# Altium schematic sheet [01] SYSTEM_POWER.SchDoc (part 3 of 3)
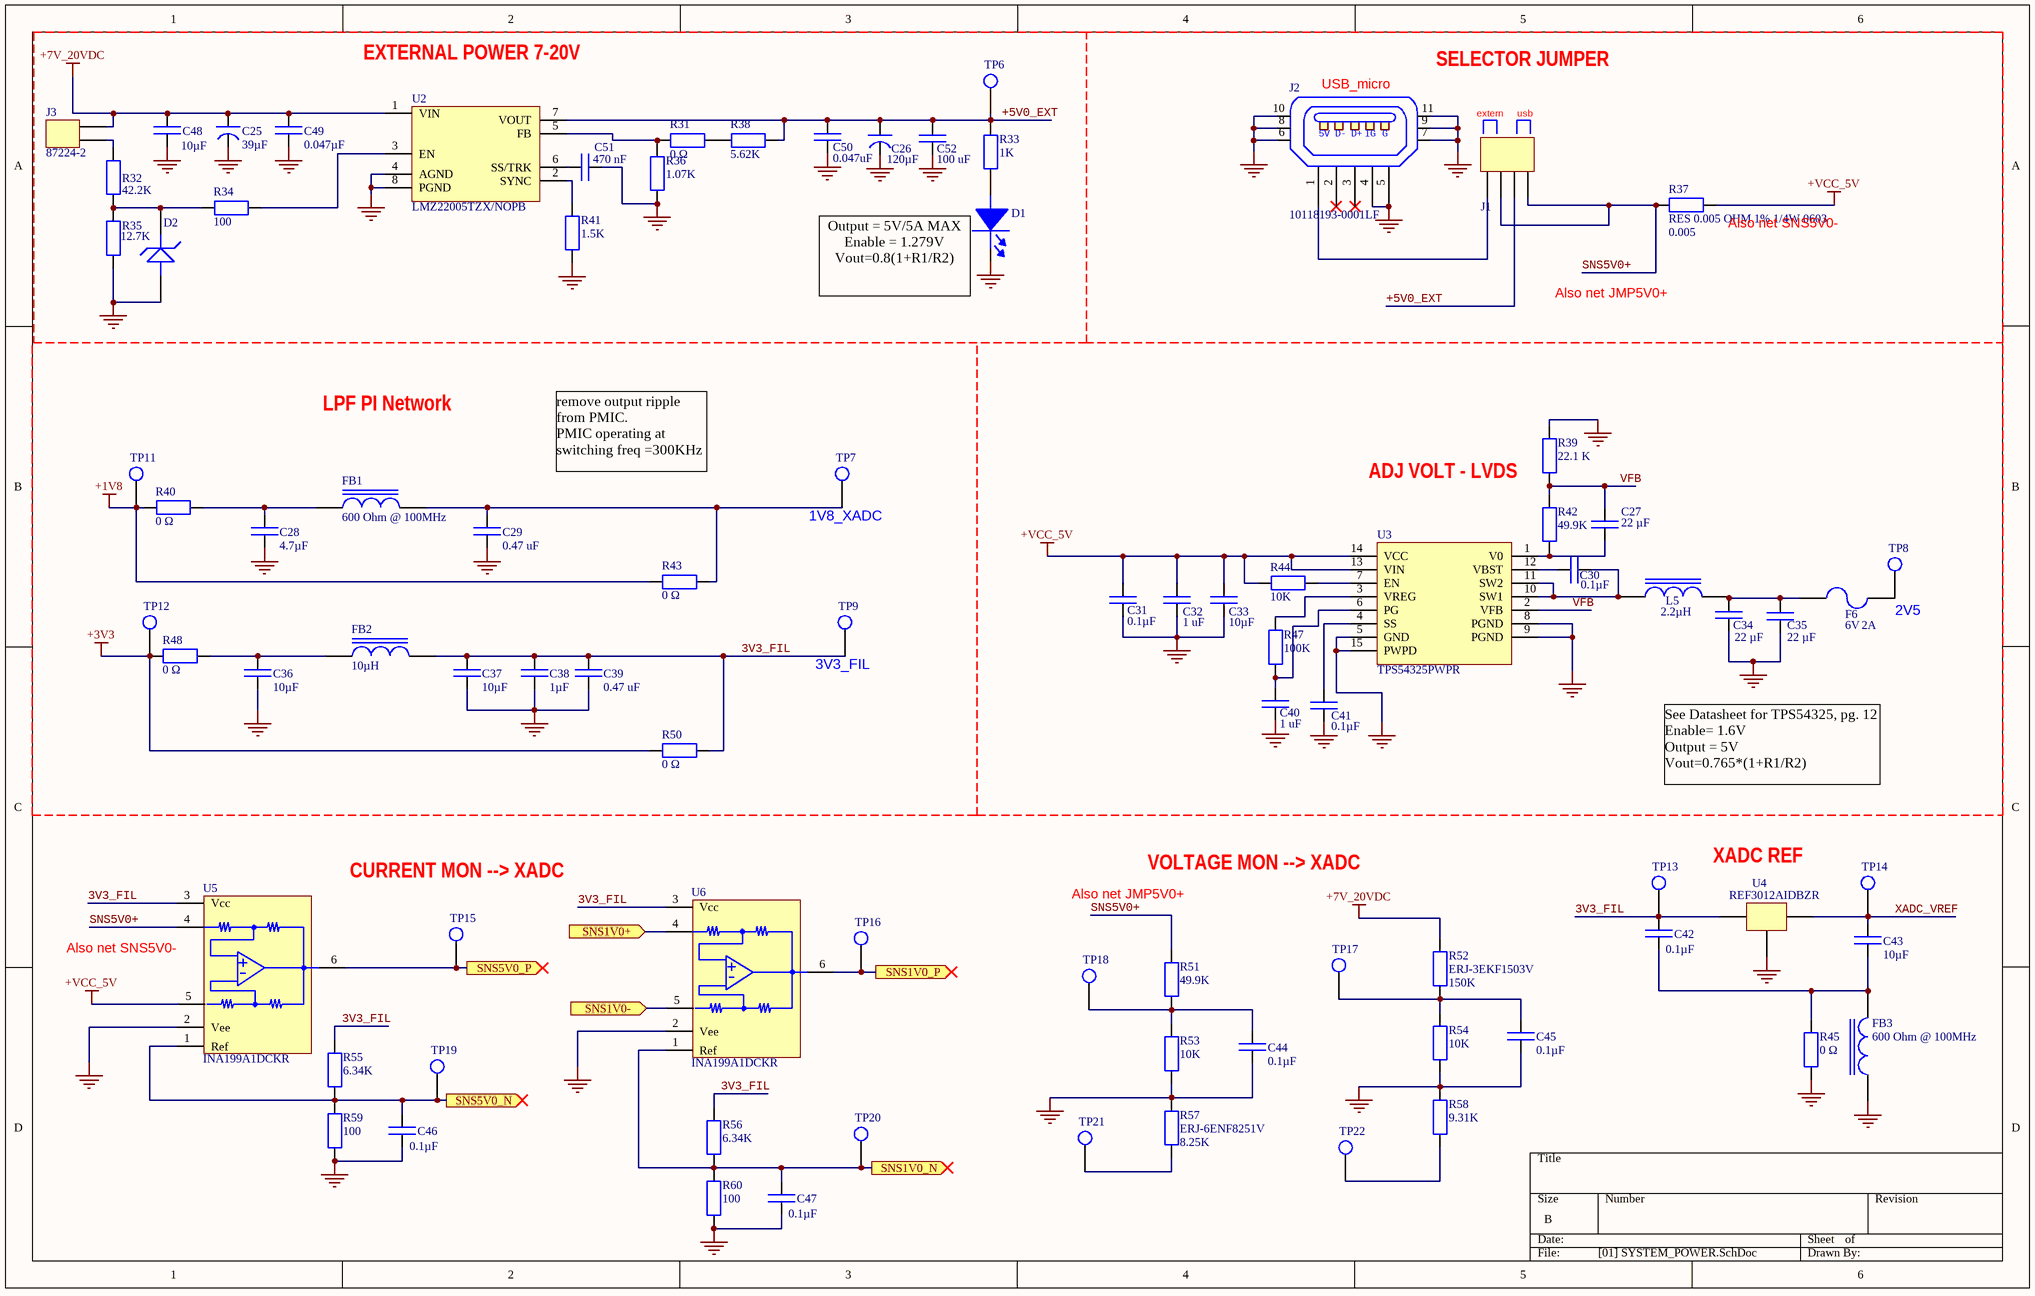
[diagram p2: [01] SYSTEM_POWER.SchDoc]

## Library data of the parts (continued)
R35 = ERJ-3EKF1272V: RES SMD 12.7K OHM 1% 1/10W 0603; Manufacturer: Panasonic; Rated Power: 0.1 W; Temp Coefficient: ±100 ppm/°C; Supplier 1: Digi-Key; Manufacturer Part Number: ERJ-3EKF1272V; Stock 1: 278983; Pricing 1: 1=0.1, 10=0.032, 100=0.013, 1000=0.0058, 2500=0.0051 (USD); Size Code: 0603; Tolerance (%): ±1 %; ComponentLink1URL: http://www.farnell.com/datasheets/1678782.pdf?src-supplier=Element14; ComponentLink1Description: http://www.farnell.com/datasheets/1678782.pdf?src-supplier=Element14; ComponentLink2URL: http://www.farnell.com/datasheets/426256.pdf?src-supplier=Element14; ComponentLink2Description: http://www.farnell.com/datasheets/426256.pdf?src-supplier=Element14; ComponentLink3URL: http://www.alliedelec.com/m/d/623f45ff1957d936ff56d46fd1c28cac.pdf?src-supplier=Allied+Electronics; ComponentLink3Description: http://www.alliedelec.com/m/d/623f45ff1957d936ff56d46fd1c28cac.pdf?src-supplier=Allied+Electronics; ComponentLink4URL: http://industrial.panasonic.com/www-data/pdf/AOA0000/AOA0000CE2.pdf?src-supplier=Avnet; ComponentLink4Description: http://industrial.panasonic.com/www-data/pdf/AOA0000/AOA0000CE2.pdf?src-supplier=Avnet; Supplier Part Number 1: P12.7KHCT-ND
R36 = ERJ-6ENF1071V: RES SMD 1.07K OHM 1% 1/8W 0805; Manufacturer: Panasonic; EDA / CAD Models: Download from Accelerated Designs; Power (Watts): 0.125W, 1/8W; Temperature Coefficient: ±100ppm/°C; Online Catalog: ERJ Series; Kits: RSM3CA-ND  - RES KIT 1K-9.76K 1/8W 4800PCS RSM3C-ND  - RES KIT 1K-9.76K 1/8W 19200PCS; Other Names: ERJ-6ENF1071 ERJ6ENF1071 P1.07KCBK P1.07KCCT; Supplier 1: Digi-Key; Manufacturer Part Number: ERJ-6ENF1071V; Stock 1: 40812; Pricing 1: 1=0.1, 10=0.072, 100=0.0275, 1000=0.0121, 2500=0.0105 (USD); Standard Package: 1; Category: Resistors; Family: Chip Resistor - Surface Mount; Series: ERJ; Packaging: Cut Tape (CT); Tolerance: ±1%; Composition: Thick Film; Features: Automotive AEC-Q200; Operating Temperature: -55°C ~ 155°C; Package / Case: 0805 (2012 Metric); Supplier Device Package: 0805; Size / Dimension: 0.079" L x 0.049" W (2.00mm x 1.25mm); Height: 0.028" (0.70mm); Number of Terminations: 2; ComponentLink1URL: http://industrial.panasonic.com/www-data/pdf/AOA0000/AOA0000CE2.pdf?src-supplier=Avnet; ComponentLink1Description: http://industrial.panasonic.com/www-data/pdf/AOA0000/AOA0000CE2.pdf?src-supplier=Avnet; ComponentLink2URL: http://www.mouser.com/ds/2/315/AOA0000C283-1093288.pdf?src-supplier=Mouser; ComponentLink2Description: http://www.mouser.com/ds/2/315/AOA0000C283-1093288.pdf?src-supplier=Mouser; Supplier Part Number 1: P1.07KCCT-ND
R37 = ERJ-3LWFR005V: Manufacturer: Panasonic; Power (Watts): 0.25W, 1/4W; Temperature Coefficient: 0/ +700ppm/°C; Supplier 1: Digi-Key; Manufacturer Part Number: ERJ-3LWFR005V; Stock 1: 76322; Pricing 1: 1=0.51, 10=0.39, 25=0.2964, 50=0.2202, 100=0.1638, 250=0.1384, 500=0.1186, 1000=0.0904 (USD); Category: Resistors; Family: Chip Resistor - Surface Mount; Series: ERJ; Packaging: Tape & Reel (TR); Tolerance: ±1%; Composition: Thick Film; Features: Automotive AEC-Q200, Current Sense; Operating Temperature: -55°C ~ 125°C; Package / Case: 0603 (1608 Metric); Supplier Device Package: 0603; Size / Dimension: 0.063" L x 0.031" W (1.60mm x 0.80mm); Height: 0.026" (0.65mm); Number of Terminations: 2; ComponentLink1URL: http://www.mouser.com/ds/2/315/AOA0000C295-1109214.pdf?src-supplier=Mouser; ComponentLink1Description: http://www.mouser.com/ds/2/315/AOA0000C295-1109214.pdf?src-supplier=Mouser; ComponentLink2URL: https://industrial.panasonic.com/cdbs/www-data/pdf/RDN0000/AOA0000C313.pdf?src-supplier=Digi-Key; ComponentLink2Description: https://industrial.panasonic.com/cdbs/www-data/pdf/RDN0000/AOA0000C313.pdf?src-supplier=Digi-Key; ComponentLink3URL: http://www.farnell.com/datasheets/2631545.pdf?src-supplier=Farnell; ComponentLink3Description: http://www.farnell.com/datasheets/2631545.pdf?src-supplier=Farnell; ComponentLink4URL: http://www.farnell.com/datasheets/2631545.pdf?src-supplier=Newark; ComponentLink4Description: http://www.farnell.com/datasheets/2631545.pdf?src-supplier=Newark; Supplier Part Number 1: P19182CT-ND
R38 = ERJ-6ENF5621V: RES SMD 5.62K OHM 1% 1/8W 0805; Manufacturer: Panasonic; Resistor Element Type: Thick Film; Product Range: PANASONIC - ERJ Series; Power Rating: 125mW; Resistor Case Style: 0805 [2012 Metric]; Temperature Coefficient: ± 100ppm/°C; Voltage Rating: 150V; SVHC: Diboron trioxide (19-Dec-2012); SVHC (Secondary): Lead monoxide (lead oxide) (19-Dec-2012); Supplier 1: Digi-Key; Manufacturer Part Number: ERJ-6ENF5621V; Stock 1: 24844; Pricing 1: 1=0.1, 10=0.072, 100=0.0275, 1000=0.0121, 2500=0.0105 (USD); Resistance Tolerance: ± 1%; Resistor Element Material: Thick Film; Packaging: Cut Tape; MSL: (Not Applicable); Resistor Mounting: SMD; ComponentLink1URL: http://industrial.panasonic.com/www-data/pdf/AOA0000/AOA0000CE2.pdf?src-supplier=Avnet; ComponentLink1Description: http://industrial.panasonic.com/www-data/pdf/AOA0000/AOA0000CE2.pdf?src-supplier=Avnet; ComponentLink2URL: http://www.farnell.com/datasheets/426256.pdf?src-supplier=Element14; ComponentLink2Description: http://www.farnell.com/datasheets/426256.pdf?src-supplier=Element14; ComponentLink3URL: http://www.farnell.com/datasheets/1911175.pdf?src-supplier=Farnell; ComponentLink3Description: http://www.farnell.com/datasheets/1911175.pdf?src-supplier=Farnell; ComponentLink4URL: http://industrial.panasonic.com/www-data/pdf/AOA0000/AOA0000CE2.pdf?src-supplier=Avnet+Europe; ComponentLink4Description: http://industrial.panasonic.com/www-data/pdf/AOA0000/AOA0000CE2.pdf?src-supplier=Avnet+Europe; ComponentLink5URL: http://www.farnell.com/datasheets/1678782.pdf?src-supplier=Element14; ComponentLink5Description: http://www.farnell.com/datasheets/1678782.pdf?src-supplier=Element14; Supplier Part Number 1: P5.62KCCT-ND
R39 = ERJ-3EKF2212V: RES SMD 22.1K OHM 1% 1/10W 0603; Manufacturer: Panasonic; Rated Power: 0.1 W; Temp Coefficient: ±100 ppm/°C; Supplier 1: Digi-Key; Manufacturer Part Number: ERJ-3EKF2212V; Stock 1: 927679; Pricing 1: 1=0.1, 10=0.064, 100=0.0258, 1000=0.0116, 2500=0.0101 (USD); Size Code: 0603; Tolerance (%): ±1 %; ComponentLink1URL: http://industrial.panasonic.com/cdbs/www-data/pdf/RDA0000/AOA0000C304.pdf?src-supplier=Farnell; ComponentLink1Description: http://industrial.panasonic.com/cdbs/www-data/pdf/RDA0000/AOA0000C304.pdf?src-supplier=Farnell; ComponentLink2URL: http://www.mouser.com/ds/2/315/AOA0000C283-1093288.pdf?src-supplier=Mouser; ComponentLink2Description: http://www.mouser.com/ds/2/315/AOA0000C283-1093288.pdf?src-supplier=Mouser; ComponentLink3URL: http://www.farnell.com/datasheets/1678782.pdf?src-supplier=Element14; ComponentLink3Description: http://www.farnell.com/datasheets/1678782.pdf?src-supplier=Element14; ComponentLink4URL: http://industrial.panasonic.com/www-data/pdf/AOA0000/AOA0000CE2.pdf?src-supplier=Future+Electronics; ComponentLink4Description: http://industrial.panasonic.com/www-data/pdf/AOA0000/AOA0000CE2.pdf?src-supplier=Future+Electronics; ComponentLink5URL: http://industrial.panasonic.com/www-data/pdf/AOA0000/AOA0000CE2.pdf?src-supplier=Avnet+Europe; ComponentLink5Description: http://industrial.panasonic.com/www-data/pdf/AOA0000/AOA0000CE2.pdf?src-supplier=Avnet+Europe; ComponentLink6URL: http://industrial.panasonic.com/www-data/pdf/AOA0000/AOA0000CE2.pdf?src-supplier=Avnet; ComponentLink6Description: http://industrial.panasonic.com/www-data/pdf/AOA0000/AOA0000CE2.pdf?src-supplier=Avnet; ComponentLink7URL: https://www.alliedelec.com/m/d/623f45ff1957d936ff56d46fd1c28cac.pdf?src-supplier=Allied+Electronics; ComponentLink7Description: https://www.alliedelec.com/m/d/623f45ff1957d936ff56d46fd1c28cac.pdf?src-supplier=Allied+Electronics; ComponentLink8URL: http://www.jameco.com/Jameco/Products/ProdDS/1987775.pdf?src-supplier=Jameco; ComponentLink8Description: http://www.jameco.com/Jameco/Products/ProdDS/1987775.pdf?src-supplier=Jameco; ComponentLink9URL: http://industrial.panasonic.com/cdbs/www-data/pdf/RDA0000/AOA0000C304.pdf?src-supplier=Element14; ComponentLink9Description: http://industrial.panasonic.com/cdbs/www-data/pdf/RDA0000/AOA0000C304.pdf?src-supplier=Element14; Supplier Part Number 1: P22.1KHCT-ND
R41 = ERJ-3EKF1501V: RES SMD 1.5K OHM ±1% 1/10W 0603; Manufacturer: Panasonic; Power Rating: 100 mW; Temperature Coefficient: 100 PPM / C; Voltage Rating: 75 V; Qualification: AEC-Q200; Unit Weight: 0.000071 oz; Supplier 1: Digi-Key; Manufacturer Part Number: ERJ-3EKF1501V; Stock 1: 1002673; Pricing 1: 1=0.1, 10=0.066, 100=0.027, 1000=0.0121, 2500=0.0105 (USD); Product Category: Thick Film Resistors; RoHS: True; Tolerance: 1 %; Case Code - in: 0603; Case Code - mm: 1608; Operating Temperature Range: - 55 C to + 155 C; Series: ERJ; Type: Precision Thick Film Resistors SMD; Brand: Panasonic; Features: High reliability, Small Size and Light Weight; Height: 0.45 mm; Length: 1.6 mm; Package / Case: 0603 (1608 metric); Packaging: Reel; Product: Thick Film Resistors SMD; Factory Pack Quantity: 5000; Termination Style: SMD/SMT; Width: 0.8 mm; ComponentLink1URL: http://www.farnell.com/datasheets/426256.pdf?src-supplier=Element14; ComponentLink1Description: http://www.farnell.com/datasheets/426256.pdf?src-supplier=Element14; ComponentLink2URL: http://industrial.panasonic.com/www-data/pdf/AOA0000/AOA0000CE2.pdf?src-supplier=Avnet; ComponentLink2Description: http://industrial.panasonic.com/www-data/pdf/AOA0000/AOA0000CE2.pdf?src-supplier=Avnet; ComponentLink3URL: http://www.jameco.com/Jameco/Products/ProdDS/1987644.pdf?src-supplier=Jameco; ComponentLink3Description: http://www.jameco.com/Jameco/Products/ProdDS/1987644.pdf?src-supplier=Jameco; ComponentLink4URL: https://industrial.panasonic.com/cdbs/www-data/pdf/RDA0000/DMA0000COL11.pdf?src-supplier=Avnet+Asia; ComponentLink4Description: https://industrial.panasonic.com/cdbs/www-data/pdf/RDA0000/DMA0000COL11.pdf?src-supplier=Avnet+Asia; ComponentLink5URL: http://industrial.panasonic.com/www-data/pdf/AOA0000/AOA0000CE2.pdf?src-supplier=Avnet+Europe; ComponentLink5Description: http://industrial.panasonic.com/www-data/pdf/AOA0000/AOA0000CE2.pdf?src-supplier=Avnet+Europe; ComponentLink6URL: http://www.farnell.com/datasheets/1678782.pdf?src-supplier=Element14; ComponentLink6Description: http://www.farnell.com/datasheets/1678782.pdf?src-supplier=Element14; ComponentLink7URL: http://industrial.panasonic.com/www-data/pdf/AOA0000/AOA0000CE2.pdf?src-supplier=Element14; ComponentLink7Description: http://industrial.panasonic.com/www-data/pdf/AOA0000/AOA0000CE2.pdf?src-supplier=Element14; ComponentLink8URL: http://industrial.panasonic.com/www-data/pdf/AOA0000/AOA0000CE2.pdf?src-supplier=Future+Electronics; ComponentLink8Description: http://industrial.panasonic.com/www-data/pdf/AOA0000/AOA0000CE2.pdf?src-supplier=Future+Electronics; ComponentLink9URL: http://www.alliedelec.com/m/d/623f45ff1957d936ff56d46fd1c28cac.pdf?src-supplier=Allied+Electronics; ComponentLink9Description: http://www.alliedelec.com/m/d/623f45ff1957d936ff56d46fd1c28cac.pdf?src-supplier=Allied+Electronics; ComponentLink10URL: http://industrial.panasonic.com/cdbs/www-data/pdf/RDA0000/AOA0000COL19.pdf?src-supplier=Mouser; ComponentLink10Description: http://industrial.panasonic.com/cdbs/www-data/pdf/RDA0000/AOA0000COL19.pdf?src-supplier=Mouser; Supplier Part Number 1: P1.50KHCT-ND
R42 R51 = ERJ-3EKF4992V: RES SMD 49.9K OHM 1% 1/10W 0603; Manufacturer: Panasonic; Rated Power: 0.1 W; Temp Coefficient: ±100 ppm/°C; Supplier 1: Digi-Key; Stock 1: 110527; Pricing 1: 1=0.1, 10=0.035, 100=0.0143, 1000=0.0064, 2500=0.0056 (USD); Size Code: 0603; Tolerance (%): ±1 %; ComponentLink1URL: http://industrial.panasonic.com/cdbs/www-data/pdf/RDA0000/AOA0000C304.pdf?src-supplier=Farnell; ComponentLink1Description: http://industrial.panasonic.com/cdbs/www-data/pdf/RDA0000/AOA0000C304.pdf?src-supplier=Farnell; ComponentLink2URL: http://www.farnell.com/datasheets/1911175.pdf?src-supplier=Element14; ComponentLink2Description: http://www.farnell.com/datasheets/1911175.pdf?src-supplier=Element14; ComponentLink3URL: http://industrial.panasonic.com/www-data/pdf/AOA0000/AOA0000CE2.pdf?src-supplier=Future+Electronics; ComponentLink3Description: http://industrial.panasonic.com/www-data/pdf/AOA0000/AOA0000CE2.pdf?src-supplier=Future+Electronics; ComponentLink4URL: http://industrial.panasonic.com/www-data/pdf/AOA0000/AOA0000CE2.pdf?src-supplier=Avnet+Europe; ComponentLink4Description: http://industrial.panasonic.com/www-data/pdf/AOA0000/AOA0000CE2.pdf?src-supplier=Avnet+Europe; ComponentLink5URL: http://www.farnell.com/datasheets/1911175.pdf?src-supplier=Farnell; ComponentLink5Description: http://www.farnell.com/datasheets/1911175.pdf?src-supplier=Farnell; ComponentLink6URL: http://industrial.panasonic.com/www-data/pdf/AOA0000/AOA0000CE2.pdf?src-supplier=Avnet; ComponentLink6Description: http://industrial.panasonic.com/www-data/pdf/AOA0000/AOA0000CE2.pdf?src-supplier=Avnet; ComponentLink7URL: http://www.farnell.com/datasheets/1678782.pdf?src-supplier=Element14; ComponentLink7Description: http://www.farnell.com/datasheets/1678782.pdf?src-supplier=Element14; ComponentLink8URL: https://www.verical.com/server-webapp/html/getDatasheet?partID=52039&src-supplier=Verical; ComponentLink8Description: https://www.verical.com/server-webapp/html/getDatasheet?partID=52039&src-supplier=Verical; ComponentLink9URL: http://www.jameco.com/Jameco/Products/ProdDS/1988209.pdf?src-supplier=Jameco; ComponentLink9Description: http://www.jameco.com/Jameco/Products/ProdDS/1988209.pdf?src-supplier=Jameco; Supplier Part Number 1: P49.9KHCT-ND; Manufacturer Part Number: ERJ-3EKF4992V
R44 R53 R54 = ERJ-3EKF1002V: RES SMD 10K OHM 1% 1/10W 0603; Manufacturer: Panasonic; Rated Power: 0.1 W; Temp Coefficient: 100 ppm/C; Supplier 1: Digi-Key; Manufacturer Part Number: ERJ-3EKF1002V; Stock 1: 2668173; Pricing 1: 1=0.1, 10=0.06, 100=0.0244, 1000=0.0109, 2500=0.0095 (USD); Size Code: 0603; Tolerance (%): 1 %; ComponentLink1URL: https://industrial.panasonic.com/cdbs/www-data/pdf/RDA0000/DMA0000COL11.pdf?src-supplier=Avnet+Asia; ComponentLink1Description: https://industrial.panasonic.com/cdbs/www-data/pdf/RDA0000/DMA0000COL11.pdf?src-supplier=Avnet+Asia; ComponentLink2URL: http://www.farnell.com/datasheets/1911175.pdf?src-supplier=Element14; ComponentLink2Description: http://www.farnell.com/datasheets/1911175.pdf?src-supplier=Element14; ComponentLink3URL: https://industrial.panasonic.com/cdbs/www-data/pdf/RDA0000/DMA0000COL11.pdf?src-supplier=Avnet; ComponentLink3Description: https://industrial.panasonic.com/cdbs/www-data/pdf/RDA0000/DMA0000COL11.pdf?src-supplier=Avnet; ComponentLink4URL: http://industrial.panasonic.com/www-data/pdf/AOA0000/AOA0000CE2.pdf?src-supplier=Avnet+Europe; ComponentLink4Description: http://industrial.panasonic.com/www-data/pdf/AOA0000/AOA0000CE2.pdf?src-supplier=Avnet+Europe; ComponentLink5URL: http://industrial.panasonic.com/www-data/pdf/AOA0000/AOA0000CE2.pdf?src-supplier=Avnet; ComponentLink5Description: http://industrial.panasonic.com/www-data/pdf/AOA0000/AOA0000CE2.pdf?src-supplier=Avnet; ComponentLink6URL: https://industrial.panasonic.com/cdbs/www-data/pdf/RDA0000/DMA0000COL11.pdf?src-supplier=Mouser; ComponentLink6Description: https://industrial.panasonic.com/cdbs/www-data/pdf/RDA0000/DMA0000COL11.pdf?src-supplier=Mouser; ComponentLink7URL: https://industrial.panasonic.com/cdbs/www-data/pdf/RDA0000/DMA0000COL11.pdf?src-supplier=Allied+Electronics; ComponentLink7Description: https://industrial.panasonic.com/cdbs/www-data/pdf/RDA0000/DMA0000COL11.pdf?src-supplier=Allied+Electronics; Supplier Part Number 1: P10.0KHDKR-ND
R47 = ERJ3EKF1003V: RES SMD 100K OHM 1% 1/10W 0603; Manufacturer: Panasonic; Rated Power: 0.1 W; Temp Coefficient: ±100 ppm/°C; Supplier 1: Digi-Key; Manufacturer Part Number: ERJ3EKF1003V; Stock 1: 221575; Pricing 1: 1=0.1, 10=0.062, 100=0.0252, 1000=0.0113, 2500=0.0098 (USD); Size Code: 0603; Tolerance (%): ±1 %; ComponentLink1URL: http://industrial.panasonic.com/www-data/pdf/AOA0000/AOA0000CE2.pdf?src-supplier=Future+Electronics; ComponentLink1Description: http://industrial.panasonic.com/www-data/pdf/AOA0000/AOA0000CE2.pdf?src-supplier=Future+Electronics; ComponentLink2URL: https://www.verical.com/server-webapp/html/getDatasheet?partID=247527&src-supplier=Verical; ComponentLink2Description: https://www.verical.com/server-webapp/html/getDatasheet?partID=247527&src-supplier=Verical; ComponentLink3URL: http://www.alliedelec.com/m/d/623f45ff1957d936ff56d46fd1c28cac.pdf?src-supplier=Allied+Electronics; ComponentLink3Description: http://www.alliedelec.com/m/d/623f45ff1957d936ff56d46fd1c28cac.pdf?src-supplier=Allied+Electronics; ComponentLink4URL: http://www.jameco.com/Jameco/Products/ProdDS/1987476.pdf?src-supplier=Jameco; ComponentLink4Description: http://www.jameco.com/Jameco/Products/ProdDS/1987476.pdf?src-supplier=Jameco; Supplier Part Number 1: P100KHCT-ND
R52 = ERJ-3EKF1503V: RES SMD 150K OHM 1% 1/10W 0603; Manufacturer: Panasonic; Case Style: Molded; Temperature Coefficient: ±100 ppm/°C; Lead Finish: Tin; Supplier 1: Digi-Key; Manufacturer Part Number: ERJ-3EKF1503V; Stock 1: 81478; Pricing 1: 1=0.1, 10=0.058, 100=0.0234, 1000=0.0105, 2500=0.0091 (USD); Case Size: 0603; Type: Thick Film; Tolerance: 1 %; Power Rating: 1/10 W; Operating Temperature: -55 to 155 °C; Category: Resistor Fixed Single-Surface Mount; ComponentLink1URL: http://industrial.panasonic.com/www-data/pdf/AOA0000/AOA0000CE2.pdf?src-supplier=Avnet+Europe; ComponentLink1Description: http://industrial.panasonic.com/www-data/pdf/AOA0000/AOA0000CE2.pdf?src-supplier=Avnet+Europe; ComponentLink2URL: http://industrial.panasonic.com/www-data/pdf/AOA0000/AOA0000CE2.pdf?src-supplier=Avnet; ComponentLink2Description: http://industrial.panasonic.com/www-data/pdf/AOA0000/AOA0000CE2.pdf?src-supplier=Avnet; ComponentLink3URL: http://www.alliedelec.com/m/d/623f45ff1957d936ff56d46fd1c28cac.pdf?src-supplier=Allied+Electronics; ComponentLink3Description: http://www.alliedelec.com/m/d/623f45ff1957d936ff56d46fd1c28cac.pdf?src-supplier=Allied+Electronics; ComponentLink4URL: http://industrial.panasonic.com/www-data/pdf/AOA0000/AOA0000CE2.pdf?src-supplier=Element14; ComponentLink4Description: http://industrial.panasonic.com/www-data/pdf/AOA0000/AOA0000CE2.pdf?src-supplier=Element14; ComponentLink5URL: http://www.farnell.com/datasheets/426256.pdf?src-supplier=Element14; ComponentLink5Description: http://www.farnell.com/datasheets/426256.pdf?src-supplier=Element14; ComponentLink6URL: http://www.farnell.com/datasheets/1678782.pdf?src-supplier=Element14; ComponentLink6Description: http://www.farnell.com/datasheets/1678782.pdf?src-supplier=Element14; ComponentLink7URL: http://www.farnell.com/datasheets/1911175.pdf?src-supplier=Farnell; ComponentLink7Description: http://www.farnell.com/datasheets/1911175.pdf?src-supplier=Farnell; Supplier Part Number 1: P150KHCT-ND
R55 R56 = ERJ-3EKF6341V: RES SMD 6.34K OHM 1% 1/10W 0603; Manufacturer: Panasonic; Resistor Element Type: Thick Film; Product Range: PANASONIC - ERJ Series; Power Rating: 100mW; Resistor Case Style: 0603 [1608 Metric]; Temperature Coefficient: ± 100ppm/°C; Voltage Rating: 75V; SVHC: Diboron trioxide (19-Dec-2012); SVHC (Secondary): Lead monoxide (lead oxide) (19-Dec-2012); Supplier 1: Digi-Key; Manufacturer Part Number: ERJ-3EKF6341V; Stock 1: 215692; Pricing 1: 1=0.1, 10=0.05, 100=0.0203, 1000=0.0091, 2500=0.0079 (USD); Resistance Tolerance: ± 1%; Resistor Element Material: Thick Film; Packaging: Cut Tape; MSL: (Not Applicable); Resistor Mounting: SMD; ComponentLink1URL: http://www.farnell.com/datasheets/426256.pdf?src-supplier=Element14; ComponentLink1Description: http://www.farnell.com/datasheets/426256.pdf?src-supplier=Element14; ComponentLink2URL: http://www.mouser.com/ds/2/315/AOA0000C283-1093288.pdf?src-supplier=Mouser; ComponentLink2Description: http://www.mouser.com/ds/2/315/AOA0000C283-1093288.pdf?src-supplier=Mouser; ComponentLink3URL: https://www.alliedelec.com/m/d/623f45ff1957d936ff56d46fd1c28cac.pdf?src-supplier=Allied+Electronics; ComponentLink3Description: https://www.alliedelec.com/m/d/623f45ff1957d936ff56d46fd1c28cac.pdf?src-supplier=Allied+Electronics; ComponentLink4URL: http://www.farnell.com/datasheets/1911175.pdf?src-supplier=Farnell; ComponentLink4Description: http://www.farnell.com/datasheets/1911175.pdf?src-supplier=Farnell; ComponentLink5URL: http://www.farnell.com/datasheets/1678782.pdf?src-supplier=Element14; ComponentLink5Description: http://www.farnell.com/datasheets/1678782.pdf?src-supplier=Element14; ComponentLink6URL: http://industrial.panasonic.com/www-data/pdf/AOA0000/AOA0000CE2.pdf?src-supplier=Avnet; ComponentLink6Description: http://industrial.panasonic.com/www-data/pdf/AOA0000/AOA0000CE2.pdf?src-supplier=Avnet; Supplier Part Number 1: P6.34KHCT-ND
R57 = ERJ-6ENF8251V: RES SMD 8.25K OHM 1% 1/8W 0805; Manufacturer: Panasonic; Resistor Element Type: Thick Film; Temperature Coefficient: ± 100ppm/°C; Voltage Rating: 150V; SVHC: To Be Advised; Product Range: PANASONIC - ERJ Series Thick Film Chip Resistors; Power Rating: 125mW; Resistor Case Style: 0805 ^2012 Metric]; Supplier 1: Digi-Key; Manufacturer Part Number: ERJ-6ENF8251V; Stock 1: 31520; Pricing 1: 1=0.1, 10=0.072, 100=0.0275, 1000=0.0121, 2500=0.0105 (USD); Packaging: Full Reel; Resistance Tolerance: ± 1%; ComponentLink1URL: http://industrial.panasonic.com/www-data/pdf/AOA0000/AOA0000CE2.pdf?src-supplier=Avnet+Europe; ComponentLink1Description: http://industrial.panasonic.com/www-data/pdf/AOA0000/AOA0000CE2.pdf?src-supplier=Avnet+Europe; ComponentLink2URL: http://www.jameco.com/Jameco/Products/ProdDS/1989586.pdf?src-supplier=Jameco; ComponentLink2Description: http://www.jameco.com/Jameco/Products/ProdDS/1989586.pdf?src-supplier=Jameco; ComponentLink3URL: http://www.farnell.com/datasheets/426256.pdf?src-supplier=Element14; ComponentLink3Description: http://www.farnell.com/datasheets/426256.pdf?src-supplier=Element14; ComponentLink4URL: https://www.verical.com/server-webapp/html/getDatasheet?partID=29070&src-supplier=Verical; ComponentLink4Description: https://www.verical.com/server-webapp/html/getDatasheet?partID=29070&src-supplier=Verical; ComponentLink5URL: http://www.farnell.com/datasheets/1678782.pdf?src-supplier=Element14; ComponentLink5Description: http://www.farnell.com/datasheets/1678782.pdf?src-supplier=Element14; ComponentLink6URL: http://www.farnell.com/datasheets/1911175.pdf?src-supplier=Farnell; ComponentLink6Description: http://www.farnell.com/datasheets/1911175.pdf?src-supplier=Farnell; ComponentLink7URL: http://industrial.panasonic.com/cdbs/www-data/pdf/RDA0000/AOA0000C304.pdf?src-supplier=Farnell; ComponentLink7Description: http://industrial.panasonic.com/cdbs/www-data/pdf/RDA0000/AOA0000C304.pdf?src-supplier=Farnell; Supplier Part Number 1: P8.25KCCT-ND
R58 = ERJ-3EKF9311V: RES SMD 9.31K OHM 1% 1/10W 0603; Manufacturer: Panasonic; Rated Power: 0.1 W; Temp Coefficient: ±100 ppm/°C; Supplier 1: Digi-Key; Manufacturer Part Number: ERJ-3EKF9311V; Stock 1: 98740; Pricing 1: 1=0.1, 10=0.062, 100=0.0253, 1000=0.0113, 2500=0.0098 (USD); Size Code: 0603; Tolerance (%): ±1 %; ComponentLink1URL: http://industrial.panasonic.com/www-data/pdf/AOA0000/AOA0000CE2.pdf?src-supplier=Avnet; ComponentLink1Description: http://industrial.panasonic.com/www-data/pdf/AOA0000/AOA0000CE2.pdf?src-supplier=Avnet; ComponentLink2URL: http://www.farnell.com/datasheets/1678782.pdf?src-supplier=Element14; ComponentLink2Description: http://www.farnell.com/datasheets/1678782.pdf?src-supplier=Element14; ComponentLink3URL: http://industrial.panasonic.com/www-data/pdf/AOA0000/AOA0000CE2.pdf?src-supplier=Future+Electronics; ComponentLink3Description: http://industrial.panasonic.com/www-data/pdf/AOA0000/AOA0000CE2.pdf?src-supplier=Future+Electronics; ComponentLink4URL: http://industrial.panasonic.com/www-data/pdf/AOA0000/AOA0000CE2.pdf?src-supplier=Avnet+Asia; ComponentLink4Description: http://industrial.panasonic.com/www-data/pdf/AOA0000/AOA0000CE2.pdf?src-supplier=Avnet+Asia; ComponentLink5URL: http://www.farnell.com/datasheets/1911175.pdf?src-supplier=Farnell; ComponentLink5Description: http://www.farnell.com/datasheets/1911175.pdf?src-supplier=Farnell; ComponentLink6URL: https://www.alliedelec.com/m/d/623f45ff1957d936ff56d46fd1c28cac.pdf?src-supplier=Allied+Electronics; ComponentLink6Description: https://www.alliedelec.com/m/d/623f45ff1957d936ff56d46fd1c28cac.pdf?src-supplier=Allied+Electronics; ComponentLink7URL: http://industrial.panasonic.com/www-data/pdf/AOA0000/AOA0000CE2.pdf?src-supplier=Avnet+Europe; ComponentLink7Description: http://industrial.panasonic.com/www-data/pdf/AOA0000/AOA0000CE2.pdf?src-supplier=Avnet+Europe; ComponentLink8URL: http://www.mouser.com/ds/2/315/AOA0000CE2-37512.pdf?src-supplier=Mouser; ComponentLink8Description: http://www.mouser.com/ds/2/315/AOA0000CE2-37512.pdf?src-supplier=Mouser; ComponentLink9URL: http://www.farnell.com/datasheets/1911175.pdf?src-supplier=Element14; ComponentLink9Description: http://www.farnell.com/datasheets/1911175.pdf?src-supplier=Element14; Supplier Part Number 1: P9.31KHCT-ND
TP6-TP9 TP11-TP22 = 5017: PCB MINI TEST POINT; Manufacturer: Keystone Electronics; Minimum Quantity: PC Test Point, Miniature; Dynamic Catalog: Surface Mount Test Points; Featured Product: 5019 Miniature Surface Mount Test Point; Other Names: 5017-ND / 5017KTR / Q5021014; Supplier 1: Digi-Key; Manufacturer Part Number: 5017; Stock 1: 285000; Pricing 1: 5000=0.0924 (USD); Quantity Available: Tape & Reel (TR)Alternate Packaging; RoHS Information: RoHS Compliance Statement; Standard Package: 5,000; Category: Test and Measurement; Family: Test Points; Packaging: Tape & Reel (TR); Type: PC Test Point, Miniature; Terminal: 0.010" (0.25mm) Phosphor Bronze, Silver Plated; Mounting Type: Surface Mount; Material: Phosphor Bronze; Online Catalog: Surface Mount Test Points; ComponentLink1URL: http://www.keyelco.com/product-pdf.cfm?p=1355&src-supplier=Digi-Key; ComponentLink1Description: http://www.keyelco.com/product-pdf.cfm?p=1355&src-supplier=Digi-Key; Supplier Part Number 1: 36-5017TR-NDL
U2 = LMZ22005TZX/NOPB: DC DC CONVERTER 0.8-6V; Manufacturer: TI National Semiconductor; Output Power: 30W; Number of Outputs: 1; Output Current: 5A; Screening Level: Automotive; Product Length (mm): 10.16mm; Product Height (mm): 4.57mm; Product Depth (mm): Surface Mount; Supplier 1: Digi-Key; Stock 1: 1814; Pricing 1: 1=9.19, 5=9.124, 10=9.055, 25=8.9156, 50=8.637, 100=7.8012, 250=7.6619 (USD); Mounting Style: Surface Mount; Packaging: Tape and Reel; Operating Temperature (Min): -40C; Type: Step Down; Pin Count: Tape and Reel; Package / Case: -40C; Operating Temperature (Max): 125C; ComponentLink1URL: http://www.ti.com/lit/ds/symlink/lmz22005.pdf?src-supplier=Digi-Key; ComponentLink1Description: http://www.ti.com/lit/ds/symlink/lmz22005.pdf?src-supplier=Digi-Key; Supplier Part Number 1: 296-43603-1-ND; Manufacturer Part Number: LMZ22005TZX/NOPB
U3 = TPS54325PWPR: IC REG BUCK ADJ 3A SYNC 14HTSSOP; Manufacturer: Texas Instruments; Product Training Modules: Understanding SWIFT Step Down Dc/Dc Converters; Featured Product: TPS54325 - 3A Step-Down SWIFT™ Converter / WEBENCH Design Center; Output Type: Adjustable; Number of Outputs: 1; Voltage - Output: 0.76 V ~ 5.5 V; Voltage - Input: 2 V ~ 18 V; PWM Type: Hybrid; Frequency - Switching: 700kHz; Synchronous Rectifier: Yes; Dynamic Catalog: Buck (Step-Down) IC; Other Names: 296-24557-1; Supplier 1: Digi-Key; Manufacturer Part Number: TPS54325PWPR; Stock 1: 45243; Pricing 1: 1=1.63, 10=1.468, 25=1.3852, 100=1.108, 250=0.9695, 500=0.9418, 1000=0.7479 (USD); Standard Package: 1; Category: Integrated Circuits (ICs); Family: PMIC - Voltage Regulators - DC DC Switching Regulators; Series: SWIFT™, D-CAP2™; Type: Step-Down (Buck); Current - Output: 3A; Operating Temperature: -40°C ~ 85°C; Mounting Type: Surface Mount; Package / Case: 14-TSSOP (0.173", 4.40mm Width) Exposed Pad; Packaging: Cut Tape (CT); Supplier Device Package: 14-HTSSOP; ComponentLink1URL: http://www.ti.com/lit/ds/symlink/tps54325.pdf?src-supplier=Digi-Key; ComponentLink1Description: http://www.ti.com/lit/ds/symlink/tps54325.pdf?src-supplier=Digi-Key; ComponentLink2URL: http://www.ti.com/lit/gpn/tps54325?src-supplier=Mouser; ComponentLink2Description: http://www.ti.com/lit/gpn/tps54325?src-supplier=Mouser; ComponentLink3URL: http://www.ti.com/general/docs/lit/getliterature.tsp?genericPartNumber=TPS54325&&fileType=pdf&src-supplier=Avnet; ComponentLink3Description: http://www.ti.com/general/docs/lit/getliterature.tsp?genericPartNumber=TPS54325&&fileType=pdf&src-supplier=Avnet; ComponentLink4URL: http://datasheet.iiic.cc/texas_instruments/TPS54325PWPR.pdf?src-supplier=IIIC; ComponentLink4Description: http://datasheet.iiic.cc/texas_instruments/TPS54325PWPR.pdf?src-supplier=IIIC; ComponentLink5URL: http://www.produktinfo.conrad.com/datenblaetter/1000000-1099999/001014848-da-01-en-IC_REG_BUCK_SY_TPS54325PWPR_TSSOP_14_TID.pdf?src-supplier=Conrad; ComponentLink5Description: http://www.produktinfo.conrad.com/datenblaetter/1000000-1099999/001014848-da-01-en-IC_REG_BUCK_SY_TPS54325PWPR_TSSOP_14_TID.pdf?src-supplier=Conrad; Supplier Part Number 1: 296-24557-1-ND
U4 = REF3012AIDBZR: IC VREF SERIES 0.2% SOT23-3; Manufacturer: Texas Instruments; Reference Type: Precision; Output Voltage: 1.25 V; Maximum Input Voltage: 7 V; Maximum Temperature Coefficient: 75 ppm/°C; Line Regulation: 190 uV/V; Load Regulation: 100 uV/mA; Maximum Output Current: 25 mA; Rad Hard: No; Supplier 1: Digi-Key; Stock 1: 28859; Pricing 1: 1=1.39, 10=1.245, 25=1.1816, 100=0.9073, 250=0.8018, 500=0.7596, 1000=0.5908 (USD); Package: 3SOT-23; Packaging: Tape & Reel; Topology: Series; Initial Accuracy: 0.2 %; Operating Temperature: -40 to 125 °C; Mounting: Surface Mount; Category: Voltage Reference; ComponentLink1URL: http://www.ti.com/lit/ds/symlink/ref3012.pdf?src-supplier=Digi-Key; ComponentLink1Description: http://www.ti.com/lit/ds/symlink/ref3012.pdf?src-supplier=Digi-Key; ComponentLink2URL: http://www.ti.com/general/docs/lit/getliterature.tsp?genericPartNumber=REF3030&&fileType=pdf&src-supplier=Avnet; ComponentLink2Description: http://www.ti.com/general/docs/lit/getliterature.tsp?genericPartNumber=REF3030&&fileType=pdf&src-supplier=Avnet; Supplier Part Number 1: 296-32213-1-ND; Manufacturer Part Number: REF3012AIDBZR
U5 U6 = INA199A1DCKR: IC OPAMP CURR SENSE 14KHZ SC70-6; Manufacturer: Texas Instruments; Amplifier Type: Current Sense; Number of Circuits: 1; Slew Rate: 0.4 V/µs; Current - Input Bias: 28µA; Voltage - Input Offset: 5µV; Current - Supply: 65µA; Voltage - Supply, Single/Dual (±): 2.7 V ~ 26 V; Other Names: 296-27329-6; Supplier 1: Digi-Key; Stock 1: 158615; Pricing 1: 1=0.83, 10=0.738, 25=0.7, 100=0.5375, 250=0.475, 500=0.45, 1000=0.35 (USD); Standard Package: 1; Category: Integrated Circuits (ICs); Family: Linear - Amplifiers - Instrumentation, OP Amps, Buffer Amps; Series: -; Output Type: -; Gain Bandwidth Product: 14kHz; -3db Bandwidth: -; Current - Output / Channel: -; Operating Temperature: -40°C ~ 105°C; Mounting Type: Surface Mount; Package / Case: 6-TSSOP, SC-88, SOT-363; Supplier Device Package: SC-70-6; Packaging: Digi-Reel®; Dynamic Catalog: Current Sense; ComponentLink1URL: http://components.arrow.com/part/dataview/48823731S9057778N7713?src-supplier=Arrow; ComponentLink1Description: http://components.arrow.com/part/dataview/48823731S9057778N7713?src-supplier=Arrow; ComponentLink2URL: https://www.verical.com/server-webapp/html/getDatasheet?partID=518602&src-supplier=Verical; ComponentLink2Description: https://www.verical.com/server-webapp/html/getDatasheet?partID=518602&src-supplier=Verical; ComponentLink3URL: http://components.arrow.com/part/dataview/0323_01815168?src-supplier=Arrow+Europe; ComponentLink3Description: http://components.arrow.com/part/dataview/0323_01815168?src-supplier=Arrow+Europe; ComponentLink4URL: http://www.farnell.com/datasheets/2019159.pdf?src-supplier=Element14; ComponentLink4Description: http://www.farnell.com/datasheets/2019159.pdf?src-supplier=Element14; ComponentLink5URL: http://www.ti.com/general/docs/lit/getliterature.tsp?genericPartNumber=INA199&fileType=pdf&src-supplier=Farnell; ComponentLink5Description: http://www.ti.com/general/docs/lit/getliterature.tsp?genericPartNumber=INA199&fileType=pdf&src-supplier=Farnell; ComponentLink6URL: http://focus.ti.com/lit/ds/symlink/ina199a2.pdf?src-supplier=Avnet+Europe; ComponentLink6Description: http://focus.ti.com/lit/ds/symlink/ina199a2.pdf?src-supplier=Avnet+Europe; ComponentLink7URL: http://www.farnell.com/datasheets/1846955.pdf?src-supplier=Farnell; ComponentLink7Description: http://www.farnell.com/datasheets/1846955.pdf?src-supplier=Farnell; ComponentLink8URL: http://www.ti.com/lit/ds/symlink/ina199.pdf?src-supplier=Digi-Key; ComponentLink8Description: http://www.ti.com/lit/ds/symlink/ina199.pdf?src-supplier=Digi-Key; ComponentLink9URL: http://www.ti.com/lit/gpn/ina199?src-supplier=Mouser; ComponentLink9Description: http://www.ti.com/lit/gpn/ina199?src-supplier=Mouser; ComponentLink10URL: http://www.ti.com/general/docs/lit/getliterature.tsp?genericPartNumber=INA199&&fileType=pdf&src-supplier=Avnet; ComponentLink10Description: http://www.ti.com/general/docs/lit/getliterature.tsp?genericPartNumber=INA199&&fileType=pdf&src-supplier=Avnet; Supplier Part Number 1: 296-27329-1-ND; Manufacturer Part Number: INA199A1DCKR